# EAGLE design untitled01 (EAGLE 8.5.2)

## Sheet 1 of 3
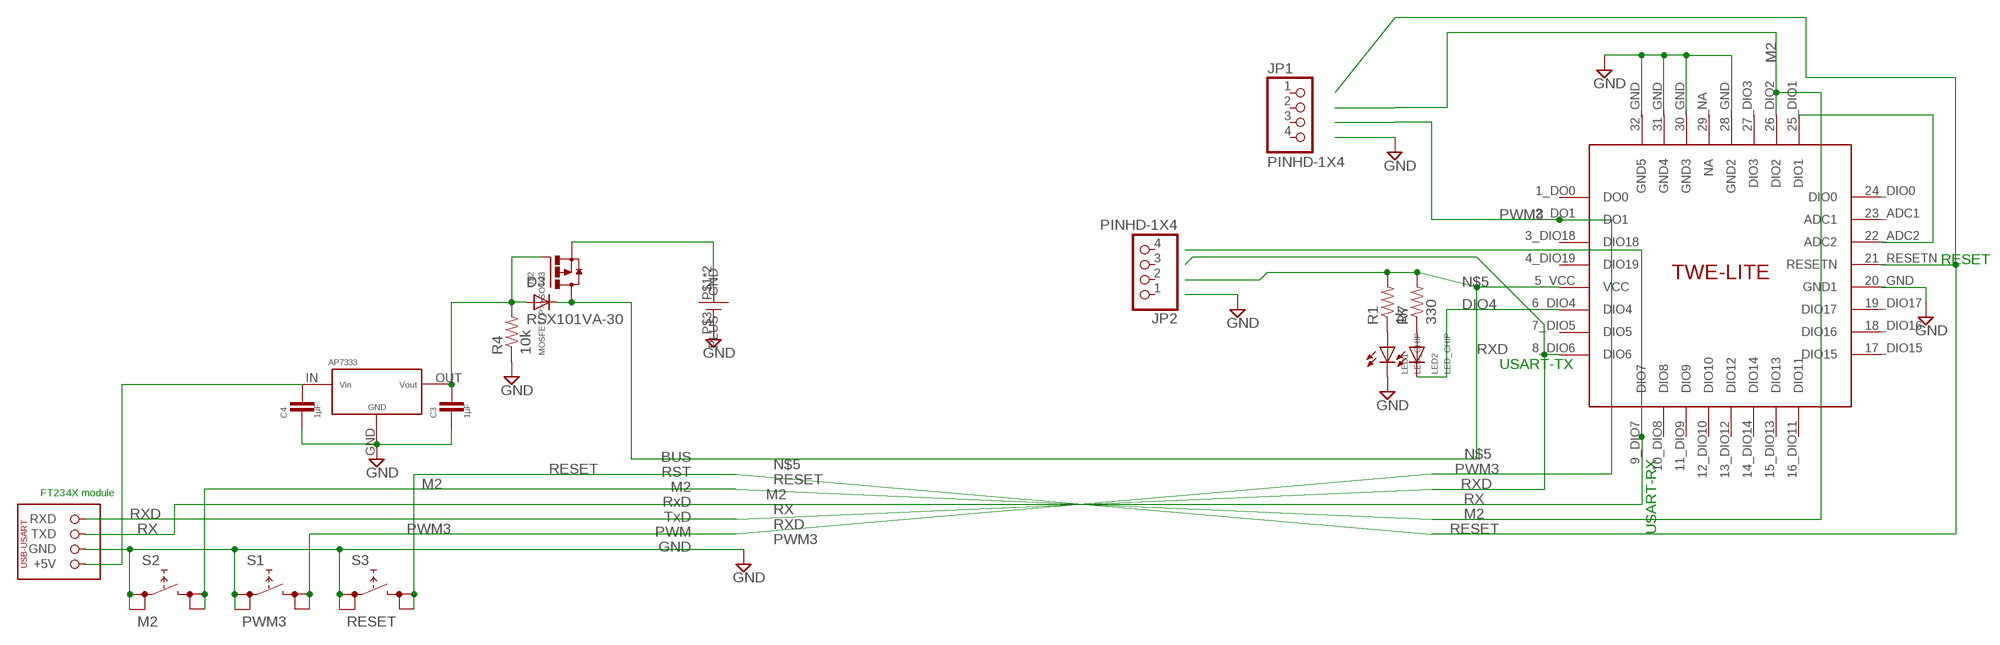
[diagram p0: schematic, sheet 1]

### Parts
C3  1μF  C>>C2012  [C2012]
C4  1μF  C>>C2012  [C2012]
D3  RSX101VA-30  [RSX101VA]
JP1  PINHD-1X4  [1X04]
JP2  PINHD-1X4  [1X04]
LED1  LED_CHIP  [2012]
LED2  LED_CHIP  [2012]
R1  1k  R-US_R0805  [R0805]
R4  10k  R-US_M0805  [M0805]
R7  330  R-US_R0805  [R0805]
S1  PWM3  LS6  [LS6]
S2  M2  LS6  [LS6]
S3  RESET  LS6  [LS6]
U$1  STL2477HLD-A  [STL2477HLD-A]
U$2  MOSFET_P>>SOT23  [SOT23]
U$3  AE-FT234X  [AE-FT234X]
U$4  AP7333_SOT-23  [AP7333_SOT-23]
U$5  TWE-001L  [TWE-001L]

### Nets
3.3V_1: C3.1 D3.ANODE(A) R4.2 U$2.1(G) U$4.OUT
BUS_POWER: C4.1 U$3.P$1(+5V) U$4.IN
DIO4: LED2.P$2(C) U$5.6_DIO4(DIO4)
DIO7: U$5.9_DIO7(DIO7)
GND: LED1.P$2(C) S1.P$1 S1.P$2 S2.P$1 S2.P$2 S3.P$1 S3.P$2 U$1.P$3(GND) U$3.P$2(GND) U$5.20_GND(GND1) U$5.28_GND(GND2) U$5.30_GND(GND3) U$5.31_GND(GND4) U$5.32_GND(GND5)
GND_1: C3.2 C4.2 R4.1 U$4.GND ; supply symbol labelled GND
M2: S2.P$3 S2.P$4 U$5.26_DIO2(DIO2)
N$2: LED2.P$1(A) R7.1
N$4: LED1.P$1(A) R1.1
N$5: D3.CATHODE(C) R1.2 R7.2 U$2.3(D) U$5.5_VCC(VCC)
N$6: U$5.22_ADC2(ADC2) U$5.25_DIO1(DIO1)
PLUS: U$1.P$1(PLUS) U$1.P$2(PLUS) U$2.2(S)
PWM3: S1.P$3 S1.P$4 U$5.2_DO1(DO1)
RESET: S3.P$3 S3.P$4 U$5.21_RESETN(RESETN)
RX: U$3.P$3(TXD)
RXD: U$3.P$4(RXD) U$5.8_DIO6(DIO6)
Unconnected: JP1.1 JP1.2 JP1.3 JP1.4 JP2.1 JP2.2 JP2.3 JP2.4 U$5.1_DO0(DO0) U$5.3_DIO18(DIO18) U$5.4_DIO19(DIO19) U$5.7_DIO5(DIO5) U$5.10_DIO8(DIO8) U$5.11_DIO9(DIO9) U$5.12_DIO10(DIO10) U$5.13_DIO12(DIO12) U$5.14_DIO14(DIO14) U$5.15_DIO13(DIO13) U$5.16_DIO11(DIO11) U$5.17_DIO15(DIO15) U$5.18_DIO16(DIO16) U$5.19_DIO17(DIO17) U$5.23_ADC1(ADC1) U$5.24_DIO0(DIO0) U$5.27_DIO3(DIO3) U$5.29_NA(NA)

### Notes on the sheet
- RESET
- USART-TX
- BUS
- RST
- M2
- FT234X module | RxD
- TxD
- PWM
- USART-RX
- GND

## Sheet 2 of 3

## Sheet 3 of 3

## Library data of the parts
C3 C4 = !Capasiter:C>>: CAPACITOR, European symbol
D3 = diodes:RSX101VA-30
JP1 JP2 = !pinhead(ﾋﾟﾝﾍｯﾀﾞ):PINHD-1X4: PIN HEADER
LED1 LED2 = !led:LED_CHIP
R1 R7 = rcl:R-US_: RESISTOR, American symbol; SPICEPREFIX: R
R4 = resistor:R-US_: RESISTOR, American symbol
S1-S3 = switch:LS6
U$1 = !battey_holder:STL2477HLD-A
U$2 = !FET_transister_v-reg:MOSFET_P>>
U$3 = !usb-usart:AE-FT234X
U$4 = Three-terminal regulator:AP7333_SOT-23
U$5 = twe-lite:TWE-001L

## Board
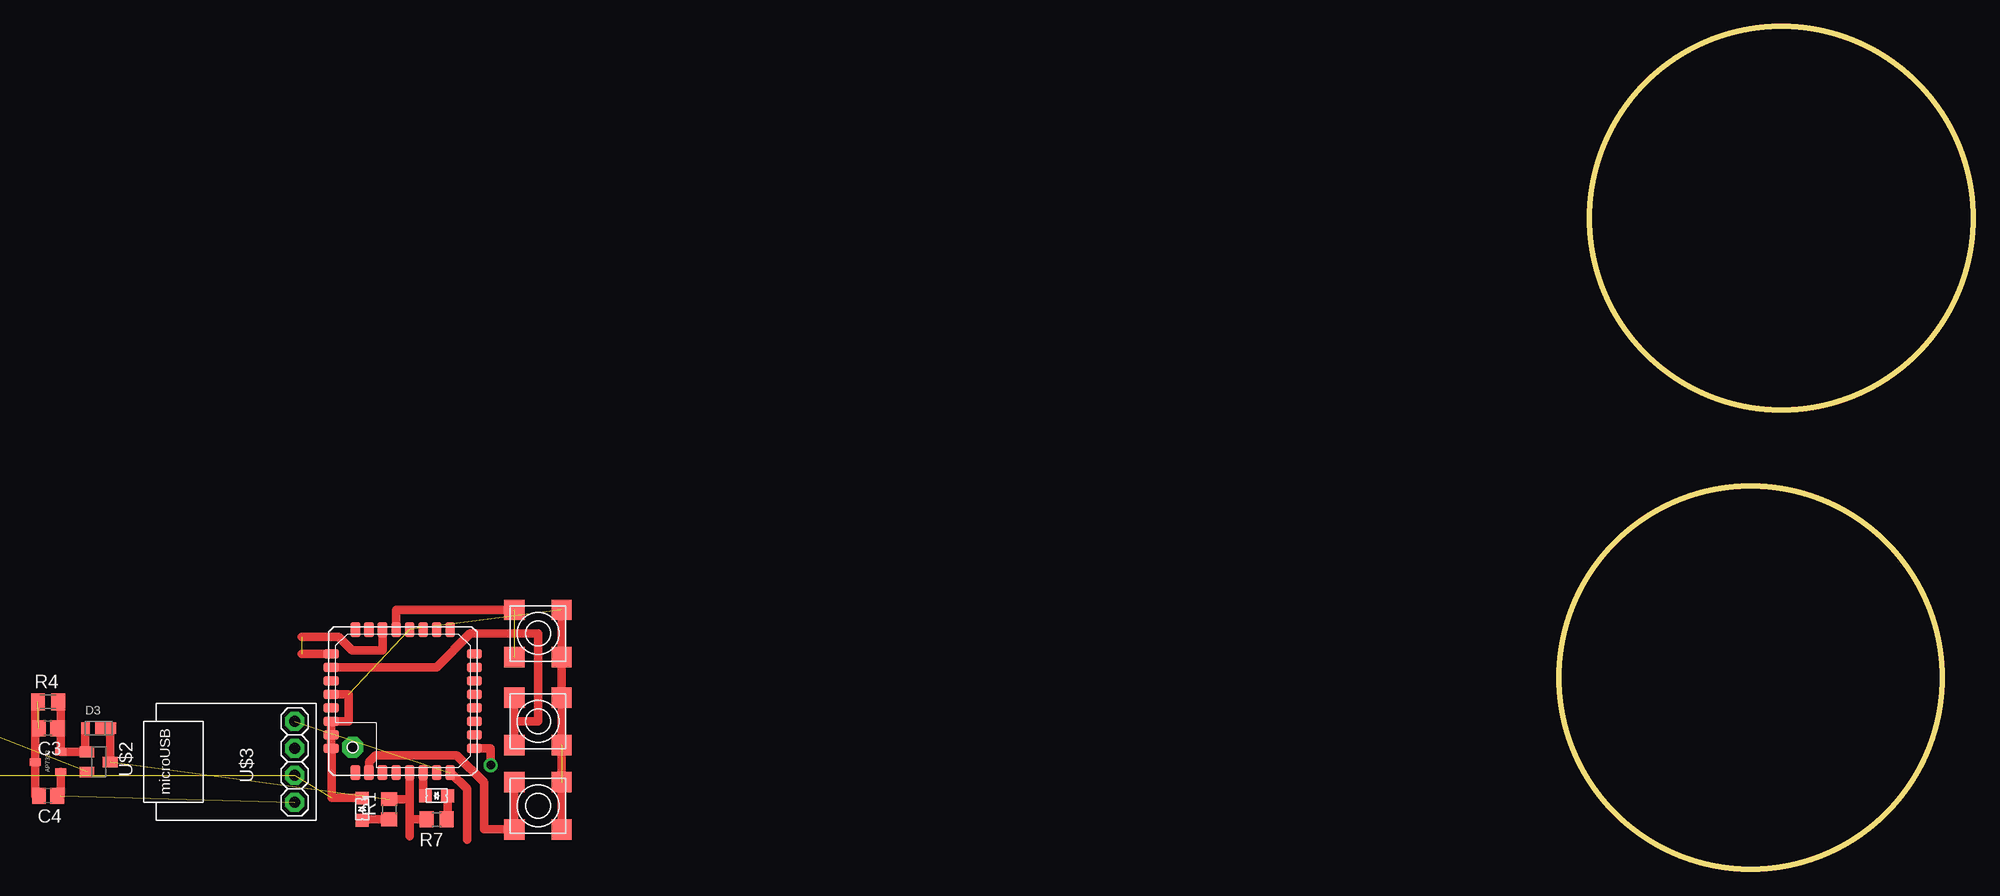
[diagram p1: board, top side]
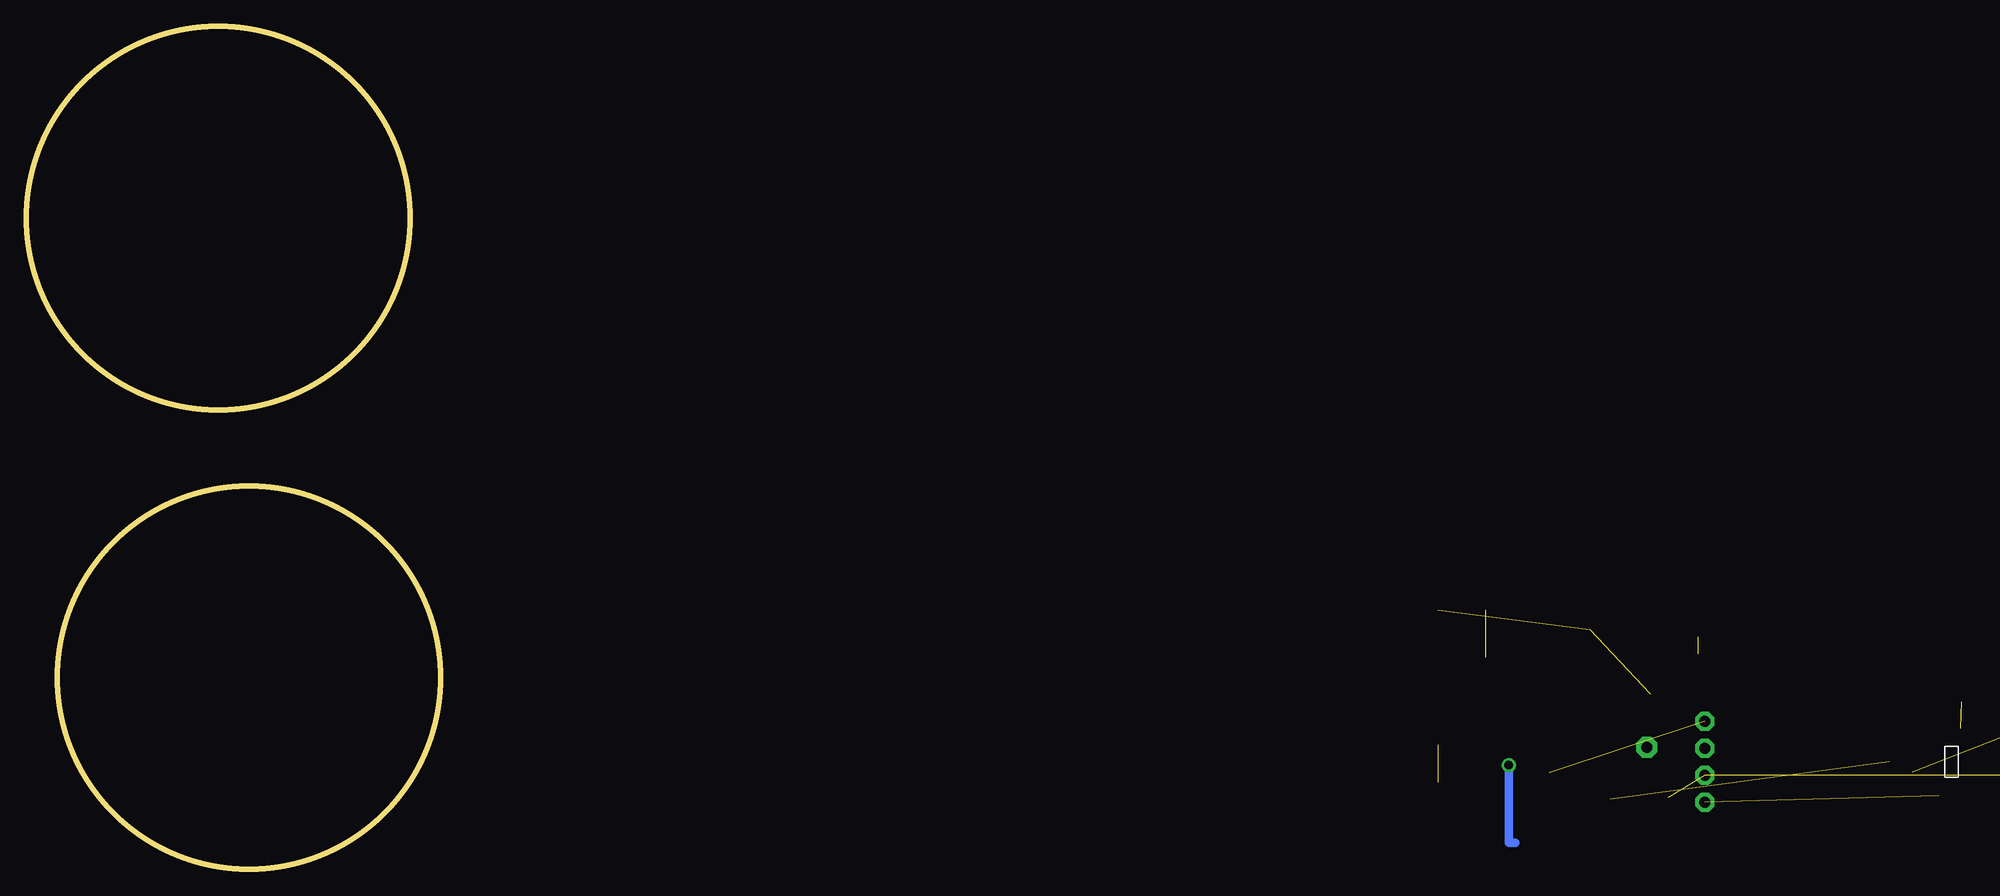
[diagram p2: board, bottom side, seen from below]

Size 38.9 x 79.18 mm. Coordinates in mm from the lower left corner, seen from the top.
Outline: circle at 20.9,61.18 radius 18
Outline: circle at 18,18 radius 18
Copper layers (1*16): Top 0.035mm / dielectric 1.5mm / Bottom 0.035mm
Design rules "yumeko": minimum track width 6mil, minimum drill 0.35mm, track to track 8mil, track to pad 8mil, pad to pad 8mil, via to via 8mil, smd to smd 8mil, copper to edge 20mil, drill to drill 8mil, minimum pad ring 10mil, minimum via ring 8mil, stop-mask expansion 4mil, vias tented up to drill 0mil, thermal gap 10mil

### Footprints (pad centres in the part's own frame; a part is rotated, then mirrored left to right if it is on the bottom)
C2012 = smd 1.3 x 1.5: 1 -0.85,0; 2 0.85,0
RSX101VA = smd 0.8 x 1.1: ANODE -1.25,0 | smd 2 x 1.1: CATHODE 0.65,0
1X04 = drill 1.016 pad 1.778 octagon: 1 -3.81,0; 2 -1.27,0; 3 1.27,0; 4 3.81,0
2012 = smd 1.2 x 1.2: P$1 -1.05,0; P$2 1.05,0
R0805 = smd 1.3 x 1.5: 1 -0.95,0; 2 0.95,0
M0805 = smd 1.3 x 1.6: 1 -0.95,0; 2 0.95,0
LS6 = smd 1.905 x 1.905: P$1 -2.223,2.223; P$2 -2.223,-2.223; P$3 2.223,2.223; P$4 2.223,-2.223
STL2477HLD-A = drill 1.85: P$1 12.7,0; P$2 -12.7,0 | smd 3.96 x 3.96: P$3 0,0
SOT23 = smd 1 x 1.4: 1 -0.95,-1.1; 2 0.95,-1.1; 3 0,1.1
AE-FT234X = drill 1.016 pad 1.778 octagon: P$1 3.81,0; P$2 1.27,0; P$3 -1.27,0; P$4 -3.81,0
AP7333_SOT-23 = smd 0.7 x 1: GND 0,1.2; IN -0.95,-1.2; OUT 0.95,-1.2
TWE-001L = smd 0.9 x 1.4: 1_DO0 -4.445,-6.735; 2_DO1 -3.175,-6.735; 3_DIO18 -1.905,-6.735; 4_DIO19 -0.635,-6.735; 5_VCC 0.635,-6.735; 6_DIO4 1.905,-6.735; 7_DIO5 3.175,-6.735; 8_DIO6 4.445,-6.735; 17_DIO15 4.445,6.735; 18_DIO16 3.175,6.735; 19_DIO17 1.905,6.735; 20_GND 0.635,6.735; 21_RESETN -0.635,6.735; 22_ADC2 -1.905,6.735; 23_ADC1 -3.175,6.735; 24_DIO0 -4.445,6.735 | smd 1.4 x 0.9: 9_DIO7 6.735,-4.445; 10_DIO8 6.735,-3.175; 11_DIO9 6.735,-1.905; 12_DIO10 6.735,-0.635; 13_DIO12 6.735,0.635; 14_DIO14 6.735,1.905; 15_DIO13 6.735,3.175; 16_DIO11 6.735,4.445; 25_DIO1 -6.735,4.445; 26_DIO2 -6.735,3.175; 27_DIO3 -6.735,1.905; 28_GND -6.735,0.635; 29_NA -6.735,-0.635; 30_GND -6.735,-1.905; 31_GND -6.735,-3.175; 32_GND -6.735,-4.445

### Placement (x,y rotation side)
C3  -141.97,13.24 180 top  (outside the outline)
C4  -141.97,6.89 180 top  (outside the outline)
D3  -137.21,13.24 0 top  (outside the outline)
JP1  -170.87,-50.58 0 top  (outside the outline)
JP2  -170.87,-32.8 0 top  (outside the outline)
LED1  -112.45,5.62 90 top  (outside the outline)
LED2  -105.46,6.89 180 top  (outside the outline)
R1  -109.91,5.62 90 top  (outside the outline)
R4  -141.97,15.71 0 top  (outside the outline)
R7  -105.46,4.67 180 top  (outside the outline)
S1  -95.94,5.94 180 top  (outside the outline)
S2  -95.94,13.87 180 top  (outside the outline)
S3  -95.94,22.13 180 top  (outside the outline)
U$1  -169.91,8.79 270 bottom  (outside the outline)
U$2  -137.21,10.06 270 top  (outside the outline)
U$3  -118.8,10.06 270 top  (outside the outline)
U$4  -141.97,10.06 90 top  (outside the outline)
U$5  -108.64,15.78 0 top  (outside the outline)

### Tracks (layer width: path | path; a pad name or v marks a point on that pad's centre or on a via)
3.3V_1
  Top 0.813: D3.ANODE -138.46,11.16 U$2.1 U$4.OUT -140.77,11.97 -140.77,13.24 | R4.2 -140.77,15.71 -140.77,13.24 | -140.77,13.24 C3.1
BUS_POWER  (1 unrouted)
  Top 0.813: C4.1 -140.77,6.89 U$4.IN
DIO4
  Top 0.813: U$5.6_DIO4 -106.73,6.89 LED2.P$2
DIO7  (via drill 0.8 pad 1.3)
  Top 0.813: U$5.9_DIO7 -100.38,11.33 v-100.38,9.75
  Bottom 0.813: v-100.38,9.75 -100.38,2.44 -101.02,2.44
GND  (5 unrouted)
  Top 0.813: U$5.28_GND -113.72,16.41 -113.72,13.87 U$5.30_GND U$5.31_GND U$5.32_GND -115.31,11.33 -115.31,6.67 LED1.P$2 | S1.P$1 S1.P$2 S3.P$1 S3.P$2 S2.P$2
GND_1  (1 unrouted)
  Top 0.813: C4.2 -143.17,6.89 U$4.GND -143.17,15.71 R4.1
M2
  Top 0.813: U$5.26_DIO2 -105.46,18.95 -102.29,22.13 -95.94,22.13 -95.94,13.87 -98.16,13.87 | S2.P$4 -98.16,13.87 | -98.16,13.87 S2.P$3
N$2
  Top 0.813: LED2.P$1 -104.41,4.67 R7.1
N$3  (via drill 1 pad 2)
  other vias: -113.35,11.43
N$4
  Top 0.813: LED1.P$1 -112.03,4.67 R1.1
N$5  (1 unrouted)
  Top 0.813: -108,6.57 -108,4.67 | -108,4.67 R7.2 | R1.2 -108,6.57 | -108,6.57 U$5.5_VCC | -108,3.08 -108,4.67 | U$2.3 -136.11,12.79 D3.CATHODE
N$6  (1 unrouted)
  Top 0.813: U$5.25_DIO1 -118.16,20.22 | U$5.22_ADC2 -110.54,20.54 -113.4,20.54 -114.67,21.81 -118.16,21.81
PLUS  (2 unrouted)
PWM3
  Top 0.813: S1.P$4 S1.P$3 -101.02,3.71 -101.02,8.16 -103.56,10.7 -111.18,10.7 -111.81,10.06 U$5.2_DO1
RESET  (1 unrouted)
  Top 0.813: U$5.21_RESETN -109.27,24.35 S3.P$4
RXD  (1 unrouted)
  Top 0.813: U$5.8_DIO6 -104.13,9.04 -102.61,7.52 -102.61,2.76